# Altium schematic sheet Probe-Scope Controller v1.0.SchDoc: Probe-Scope: Controller
size Tabloid; CompanyName: Probe-Scope; Organization: Probe-Scope; Address1: Probe-Scope: Unified USB; Address2: Oscilloscope Probe; Address3: ©2019 M. Omo, J. Rowley,; Address4: K. Hall, released under the; SheetNumber: 2; PageSetup: Record=PageOptions|CenterHorizontal=True|CenterVertical=True|PrintScale=0.96|XCorrection=1.00|YCorrection=1.00|PrintKind=1|BorderSize=5000000|LeftOffset=0|BottomOffset=0|Orientation=2|PaperLength=1000|PaperWidth=1000|Scale=100|PaperSource=7|PrintQuality=-4|MediaType=1|DitherType=10|PaperKind=11x17|PrintScaleMode=1; License: CERN OHL v1.2
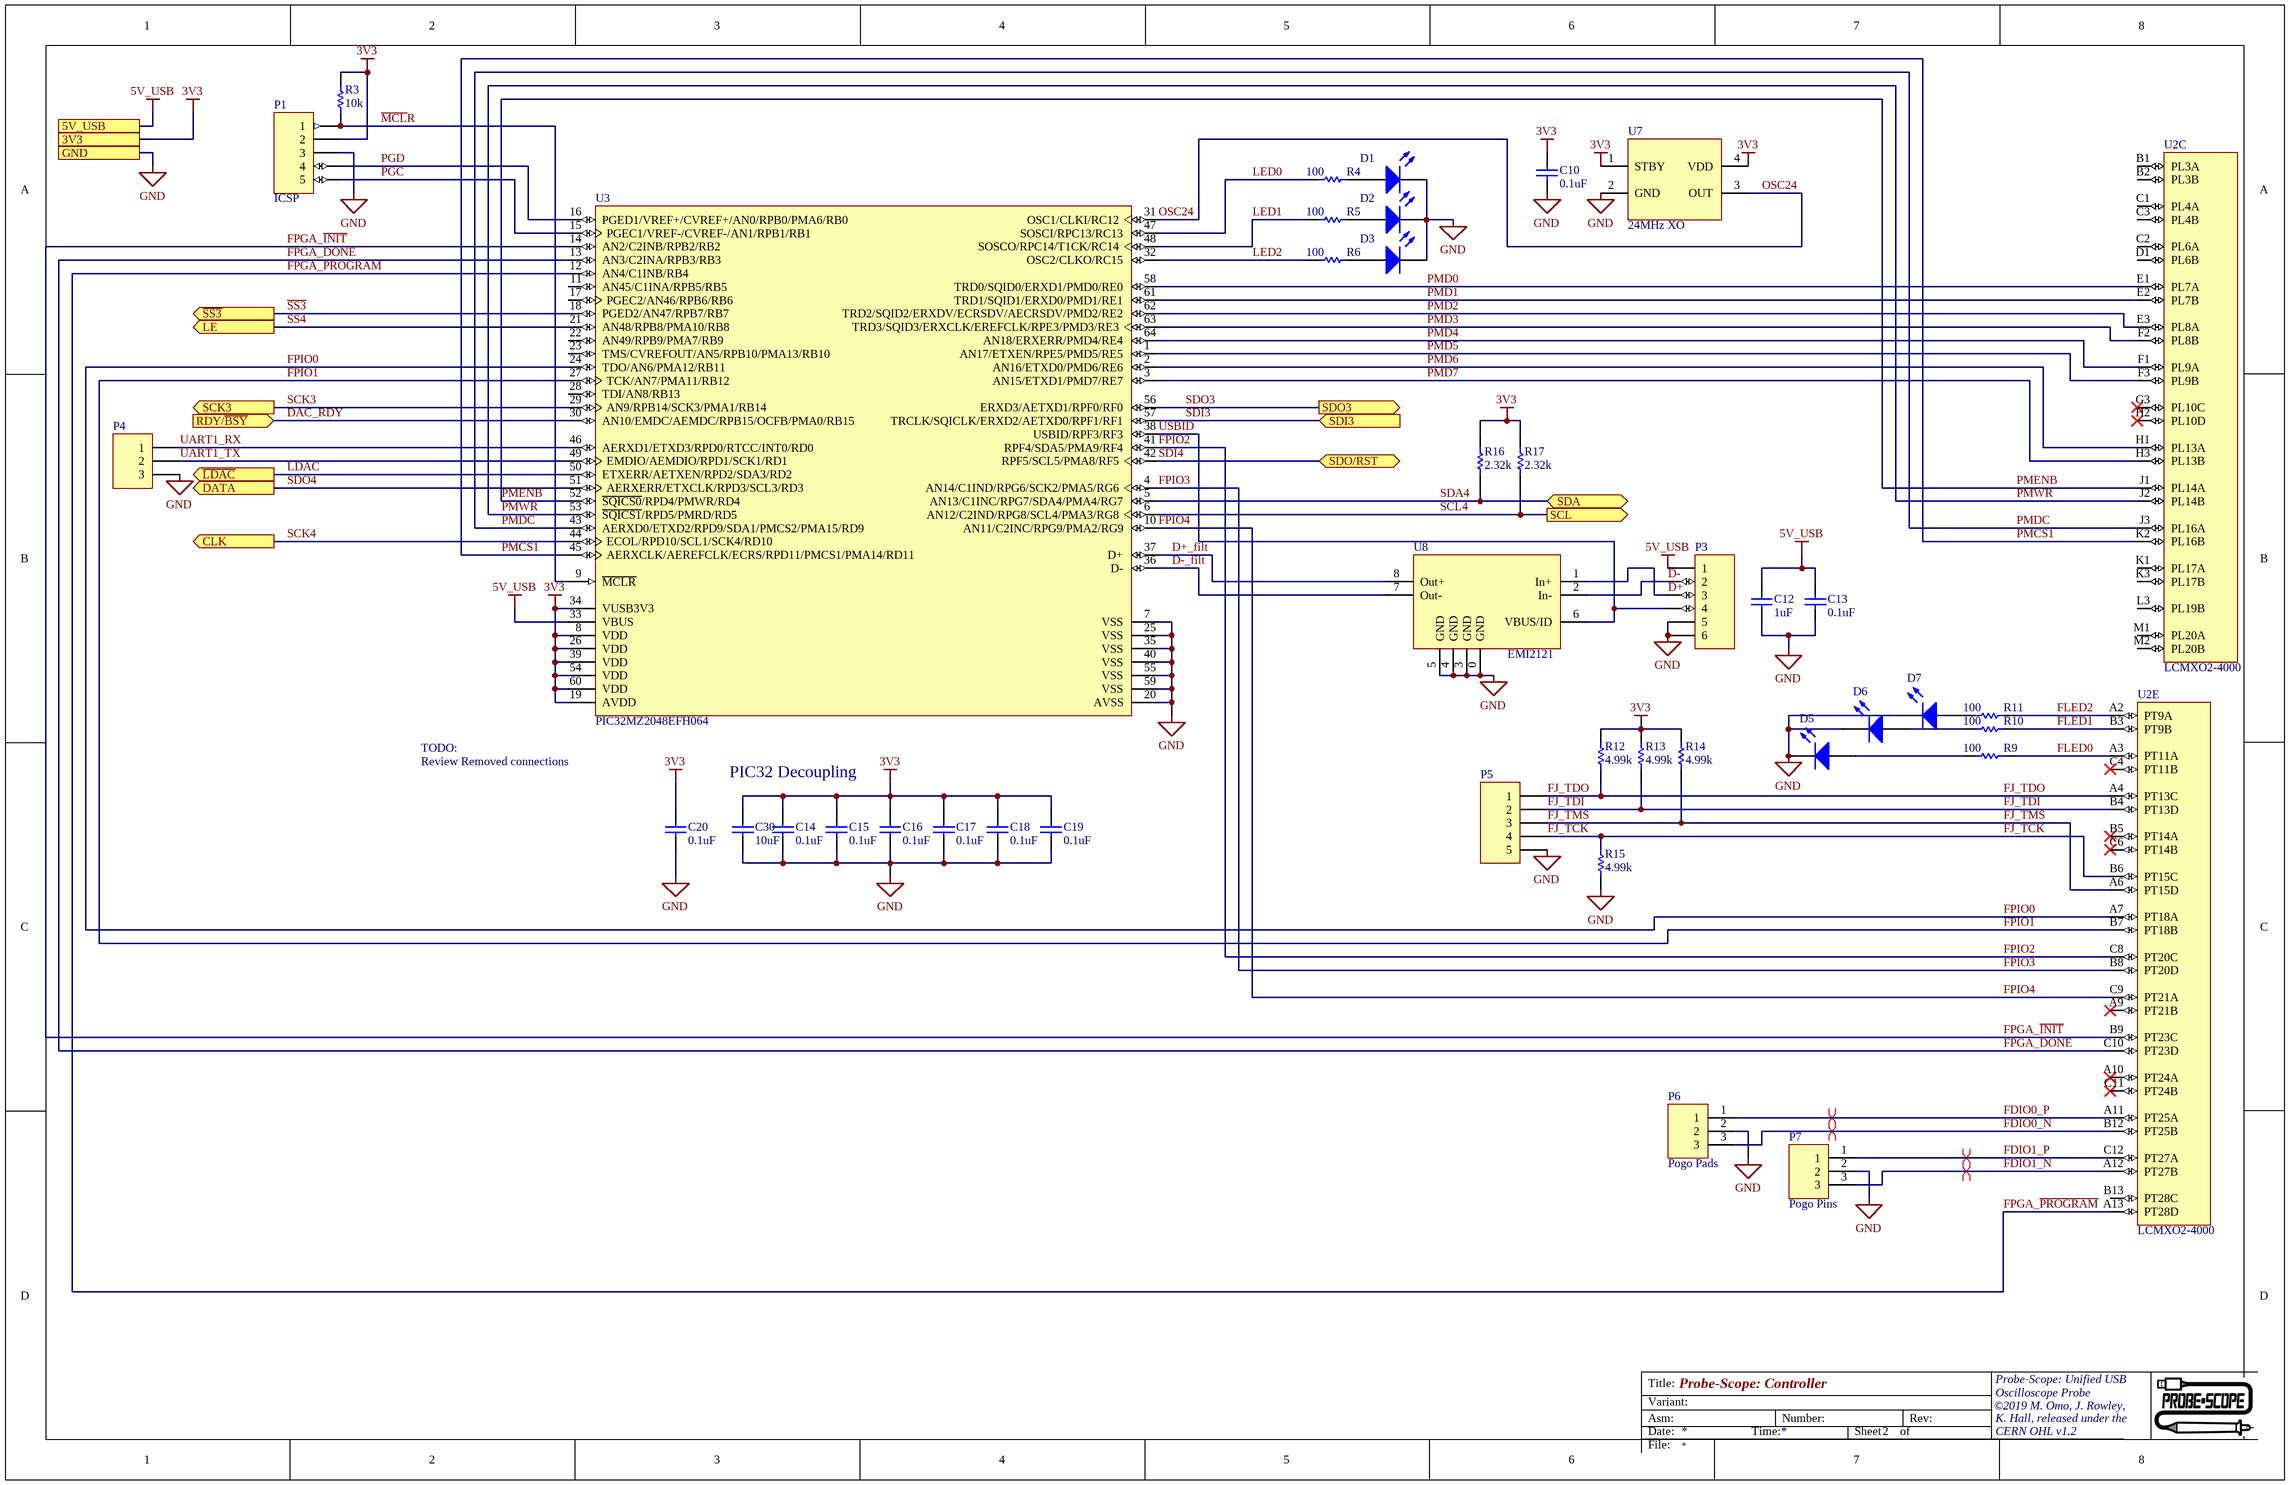
[diagram p0: Probe-Scope Controller v1.0.SchDoc]

## Parts
C10  value 0.1uF  [0402(1005)]  (hidden comment: 6.3V)
C12  value 1uF  [0402(1005)]  (hidden comment: 10V)
C13  value 0.1uF  [0402(1005)]  (hidden comment: 6.3V)
C14  value 0.1uF  [0402(1005)]  (hidden comment: 6.3V)
C15  value 0.1uF  [0402(1005)]  (hidden comment: 6.3V)
C16  value 0.1uF  [0402(1005)]  (hidden comment: 6.3V)
C17  value 0.1uF  [0402(1005)]  (hidden comment: 6.3V)
C18  value 0.1uF  [0402(1005)]  (hidden comment: 6.3V)
C19  value 0.1uF  [0402(1005)]  (hidden comment: 6.3V)
C20  value 0.1uF  [0402(1005)]  (hidden comment: 6.3V)
C30  value 10uF  [0603(1608)]  (hidden comment: 25V)
D1  Green  [0603(1608) LED]  (value not drawn)
D2  Green  [0603(1608) LED]  (value not drawn)
D3  Green  [0603(1608) LED]  (value not drawn)
D5  Green  [0603(1608) LED]  (value not drawn)
D6  Green  [0603(1608) LED]  (value not drawn)
D7  Green  [0603(1608) LED]  (value not drawn)
P1  ICSP  [MOLEX PICOBLADE 5 POS]
P3  Micro USB  [USB Micro B ZX62]  (value not drawn)
P4  PicoBlade 3  [MOLEX PICOBLADE 3 POS]  (value not drawn)
P5  PicoBlade 5  [MOLEX PICOBLADE 5 POS]  (value not drawn)
P6  Pogo Pads  [POGO_PADS_3]
P7  Pogo Pins  [POGO_PINS_3]
R3  value 10k  [0402(1005)]  (hidden comment: 0.1% 25ppm)
R4  value 100  [0402(1005)]  (hidden comment: Res1)
R5  value 100  [0402(1005)]  (hidden comment: Res1)
R6  value 100  [0402(1005)]  (hidden comment: Res1)
R9  value 100  [0402(1005)]  (hidden comment: Res1)
R10  value 100  [0402(1005)]  (hidden comment: Res1)
R11  value 100  [0402(1005)]  (hidden comment: Res1)
R12  value 4.99k  [0402(1005)]  (hidden comment: Res1)
R13  value 4.99k  [0402(1005)]  (hidden comment: Res1)
R14  value 4.99k  [0402(1005)]  (hidden comment: Res1)
R15  value 4.99k  [0402(1005)]  (hidden comment: Res1)
R16  value 2.32k  [0402(1005)]  (hidden comment: Res1)
R17  value 2.32k  [0402(1005)]  (hidden comment: Res1)
U2  LCMXO2-4000  [132_Ball_csBGA_MachXO2]  (parts C,E of 5)
U3  PIC32MZ2048EFH064  [TSQFP50P1200X1200X120-64L]
U7  24MHz XO  [DSC60xxC]
U8  EMI2121  [EMI2121]

## Ports
3V3, 5V_USB, CLK (out), DATA (out), GND, LE (out), RDY/~{BSY} (in), SCK3 (out), SCL (out), SDA (bidir), SDI3 (in), SDO3 (out), SDO/RST (bidir), ~{LDAC} (out), ~{SS3} (out)

## Nets
3V3: C10.2 C14.2 C15.2 C16.2 C17.2 C18.2 C19.2 C20.2 C30.2 P1.2 R3.2 R12.2 R13.2 R14.2 R16.2 R17.2 U3.8(VDD) U3.19(AVDD) U3.26(VDD) U3.34(VUSB3V3) U3.39(VDD) U3.54(VDD) U3.60(VDD) U7.1(STBY) U7.4(VDD) ; port 3V3
5V_USB: C12.2 C13.2 P3.1 U3.33(VBUS) ; port 5V_USB
GND: C10.1 C12.1 C13.1 C14.1 C15.1 C16.1 C17.1 C18.1 C19.1 C20.1 C30.1 D1.2(K) D2.2(K) D3.2(K) D5.2(K) D6.2(K) D7.2(K) P1.3 P3.5 P3.6 P4.3 P5.5 P6.2 P7.2 R15.1 U3.7(VSS) U3.20(AVSS) U3.25(VSS) U3.35(VSS) U3.40(VSS) U3.55(VSS) U3.59(VSS) U7.2(GND) U8.0(GND) U8.3(GND) U8.4(GND) U8.5(GND) ; port GND
~{MCL}R: P1.1 R3.1 U3.9(~{MCLR})
~{PMW}R: U2.J2(PL14B) U3.53(~{SQICS1}/RPD5/PMRD/RD5)
D+: P3.3 U8.1(In+)
D+_filt: U3.37(D+) U8.8(Out+)
D-: P3.2 U8.2(In-)
D-_filt: U3.36(D-) U8.7(Out-)
DAC_RDY: U3.30(AN10/EMDC/AEMDC/RPB15/OCFB/PMA0/RB15) ; port RDY/~{BSY}
FDIO0_N: P6.3 U2.B12(PT25B)
FDIO0_P: P6.1 U2.A11(PT25A)
FDIO1_N: P7.3 U2.A12(PT27B)
FDIO1_P: P7.1 U2.C12(PT27A)
FJ_TCK: P5.4 R15.2 U2.B6(PT15C)
FJ_TDI: P5.2 R13.1 U2.B4(PT13D)
FJ_TDO: P5.1 R12.1 U2.A4(PT13C)
FJ_TMS: P5.3 R14.1 U2.A6(PT15D)
FLED0: R9.2 U2.A3(PT11A)
FLED1: R10.2 U2.B3(PT9B)
FLED2: R11.2 U2.A2(PT9A)
FPGA_DONE: U2.C10(PT23D) U3.13(AN3/C2INA/RPB3/RB3)
FPGA_~{INIT}: U2.B9(PT23C) U3.14(AN2/C2INB/RPB2/RB2)
FPGA_~{PROGRAM}: U2.A13(PT28D) U3.12(AN4/C1INB/RB4)
FPIO0: U2.A7(PT18A) U3.24(TDO/AN6/PMA12/RB11)
FPIO1: U2.B7(PT18B) U3.27(TCK/AN7/PMA11/RB12)
FPIO2: U2.C8(PT20C) U3.41(RPF4/SDA5/PMA9/RF4)
FPIO3: U2.B8(PT20D) U3.4(AN14/C1IND/RPG6/SCK2/PMA5/RG6)
FPIO4: U2.C9(PT21A) U3.10(AN11/C2INC/RPG9/PMA2/RG9)
~{LDAC}: U3.50(ETXERR/AETXEN/RPD2/SDA3/RD2) ; port ~{LDAC}
LED0: R4.1 U3.47(SOSCI/RPC13/RC13)
LED1: R5.1 U3.48(SOSCO/RPC14/T1CK/RC14)
LED2: R6.1 U3.32(OSC2/CLKO/RC15)
OSC24: U3.31(OSC1/CLKI/RC12) U7.3(OUT)
PGC: P1.5 U3.15(PGEC1/VREF-/CVREF-/AN1/RPB1/RB1)
PGD: P1.4 U3.16(PGED1/VREF+/CVREF+/AN0/RPB0/PMA6/RB0)
PMCS1: U2.K2(PL16B) U3.45(AERXCLK/AEREFCLK/ECRS/RPD11/PMCS1/PMA14/RD11)
PMD0: U2.E1(PL7A) U3.58(TRD0/SQID0/ERXD1/PMD0/RE0)
PMD1: U2.E2(PL7B) U3.61(TRD1/SQID1/ERXD0/PMD1/RE1)
PMD2: U2.E3(PL8A) U3.62(TRD2/SQID2/ERXDV/ECRSDV/AECRSDV/PMD2/RE2)
PMD3: U2.F2(PL8B) U3.63(TRD3/SQID3/ERXCLK/EREFCLK/RPE3/PMD3/RE3)
PMD4: U2.F1(PL9A) U3.64(AN18/ERXERR/PMD4/RE4)
PMD5: U2.F3(PL9B) U3.1(AN17/ETXEN/RPE5/PMD5/RE5)
PMD6: U2.H1(PL13A) U3.2(AN16/ETXD0/PMD6/RE6)
PMD7: U2.H3(PL13B) U3.3(AN15/ETXD1/PMD7/RE7)
PMDC: U2.J3(PL16A) U3.43(AERXD0/ETXD2/RPD9/SDA1/PMCS2/PMA15/RD9)
PMENB: U2.J1(PL14A) U3.52(~{SQICS0}/RPD4/PMWR/RD4)
~{SS3}: U3.18(PGED2/AN47/RPB7/RB7) ; port ~{SS3}
~{SS4}: U3.21(AN48/RPB8/PMA10/RB8) ; port LE
SCK3: U3.29(AN9/RPB14/SCK3/PMA1/RB14) ; port SCK3
SCK4: U3.44(ECOL/RPD10/SCL1/SCK4/RD10) ; port CLK
SCL4: R17.1 U3.6(AN12/C2IND/RPG8/SCL4/PMA3/RG8) ; port SCL
SDA4: R16.1 U3.5(AN13/C1INC/RPG7/SDA4/PMA4/RG7) ; port SDA
SDI3: U3.57(TRCLK/SQICLK/ERXD2/AETXD0/RPF1/RF1) ; port SDI3
SDI4: U3.42(RPF5/SCL5/PMA8/RF5) ; port SDO/RST
SDO3: U3.56(ERXD3/AETXD1/RPF0/RF0) ; port SDO3
SDO4: U3.51(AERXERR/ETXCLK/RPD3/SCL3/RD3) ; port DATA
UART1_RX: P4.1 U3.46(AERXD1/ETXD3/RPD0/RTCC/INT0/RD0)
UART1_TX: P4.2 U3.49(EMDIO/AEMDIO/RPD1/SCK1/RD1)
USBID: P3.4 U3.38(USBID/RPF3/RF3) U8.6(VBUS/ID)
NetD1_1: D1.1(A) R4.2
NetD2_1: D2.1(A) R5.2
NetD3_1: D3.1(A) R6.2
NetD5_1: D5.1(A) R9.1
NetD6_1: D6.1(A) R10.1
NetD7_1: D7.1(A) R11.1

Not connected (* = marked no-connect by the designer): U2 A9(PT21B)* A10(PT24A)* B1(PL3A) B2(PL3B) B5(PT14A)* B13(PT28C) C1(PL4A) C2(PL6A) C3(PL4B) C4(PT11B)* C6(PT14B)* C11(PT24B)* D1(PL6B) G3(PL10C)* H2(PL10D)* K1(PL17A) K3(PL17B) L3(PL19B) M1(PL20A) M2(PL20B); U3 11(AN45/C1INA/RPB5/RB5) 17(PGEC2/AN46/RPB6/RB6) 22(AN49/RPB9/PMA7/RB9) 23(TMS/CVREFOUT/AN5/RPB10/PMA13/RB10) 28(TDI/AN8/RB13)

## Layout directives
differential pair: FDIO0_N, FDIO0_P, FDIO1_N, FDIO1_P

## Notes on the sheet
- TODO:
- Review Removed connections
- PIC32 Decoupling
- Title:
- Asm:
- Date:
- Variant:
- Time:
- Number:
- Sheet
- of
- Rev:
- File:

## Library data of the parts
C10 C13-C20 = 1875: Key: 1875; MENG_PN: ???1875; MANF: Samsung Electro-Mechanics; MANF_PN: CL05B104KQ5NNNC; VENDOR: Digikey; VENDOR_PN: 1276-1511-1-ND; P&V Description: Capacitor, Ceramic, 0.1uF, 6.3V, 10% Tol, 125C, X7R, 0402, SMD; Class: Capacitor; Type: Ceramic; Other: X7R; Tolerance: 10; Voltage: 6.3; Max Temperature: 125; Approved: False; Package: 0402; SMD: True; Date Modified: 11/6/2018 11:14:02 AM; Modified By: jrowley; Parent Key: 1875; Verified: False
C12 = 1876: Key: 1876; MENG_PN: ???1876; MANF: Murata Electronics; MANF_PN: GCM155C71A105KE38D; VENDOR: Digikey; VENDOR_PN: 490-13409-1-ND; P&V Description: Capacitor, Ceramic, 1uF, 10V, 10% Tol, 125C, X7S, 0402, SMD; Class: Capacitor; Type: Ceramic; Other: X7S; Tolerance: 10; Max Temperature: 125; Approved: False; Package: 0402; SMD: True; Date Modified: 11/6/2018 11:19:13 AM; Modified By: jrowley; Voltage: 10; Parent Key: 1876; Verified: False
C30 = 1306: Key: 1306; MENG_PN: ???1306; MANF: Samsung Electro-Mechanics; MANF_PN: CL10A106MA8NRNC; VENDOR: Digikey; VENDOR_PN: 1276-1869-1-ND; P&V Description: Capacitor, Ceramic, 10uF, 25V, 20% Tol, 85C, X5R, 0603, SMD; Class: Capacitor; Type: Ceramic; Other: X5R; Tolerance: 20; Voltage: 25; Max Temperature: 85; Approved: True; Package: 0603; SMD: True; Date Modified: 3/3/2015 11:08:29 AM; Modified By: sotterbacher; Parent Key: 1306; Verified: True
D1-D3 D5-D7 = 798: Key: 798; MENG_PN: ???798; MANF: OSRAM; MANF_PN: LG L29K-F2J1-24; VENDOR: Digikey; VENDOR_PN: 475-1193-1-ND; P&V Description: LED, 1.7V, 0.02A, Green, 570nm, diffused, 0603, SMD; Class: LED; Other: Green, 570nm, diffused; Voltage: 1.7; Current: 0.02; Approved: True; Package: 0603; SMD: True; Date Modified: 11/4/2014 3:14:11 PM; Modified By: pmarcus; Parent Key: 798; Verified: True
P1 P5 = 1316: Key: 1316; MENG_PN: ???1316; MANF: Molex; MANF_PN: 53047-0510; VENDOR: Digikey; VENDOR_PN: WM1734-ND; P&V Description: Connector, PicoBlade, 5 Positions, Male, 0.049" Spacing, 1A, 125V, Vert, Through Hole, Locking, Tin; Class: Connector; Other: Vert, Through Hole, Locking, Tin; Current: 1; Voltage: 125; Positions: 5; Spacing: 0.049; Sex: Male; Approved: True; Type: PicoBlade; SMD: False; Date Modified: 4/3/2015 6:22:35 PM; Modified By: pmarcus; Parent Key: 1316; Verified: True
P3 = 1830: Key: 1830; MENG_PN: ???1830; MANF: Amphenol FCI; MANF_PN: 10118192-0002LF; VENDOR: Digikey; VENDOR_PN: 609-5379-1-ND; P&V Description: Connector, USB, 5 Positions, Female, 0.026" Spacing, 1.8A, 100V, USB - micro B USB 2.0 Receptacle Connector 5 Position Surface Mount, Right Angle, Without Flange, SMD; Class: Connector; Other: USB - micro B USB 2.0 Receptacle Connector 5 Position Surface Mount, Right Angle, Without Flange; Positions: 5; Sex: Female; Approved: False; Current: 1.8; Voltage: 100; Spacing: 0.026; Type: USB; SMD: True; Date Modified: 8/31/2018 2:15:27 PM; Modified By: jrowley; Parent Key: 1830; Verified: False
P4 = 1286: Key: 1286; MENG_PN: ???1286; MANF: Molex; MANF_PN: 53047-0310; VENDOR: Digikey; VENDOR_PN: WM1732-ND; P&V Description: Connector, PicoBlade, 3 Positions, Male, 0.049" Spacing, 1A, 125V, Vert, Through Hole, Locking, Tin; Class: Connector; Other: Vert, Through Hole, Locking, Tin; Current: 1; Voltage: 125; Positions: 3; Spacing: 0.049; Sex: Male; Approved: True; Type: PicoBlade; SMD: False; Date Modified: 2/19/2015 4:08:35 PM; Modified By: rlaity; Parent Key: 1286; Verified: True
P6 = POGO_PADS_3
P7 = POGO_PINS_3: MANF: Prec-Dip; MANF_PN: 811-SS-003-30-002101; VENDOR: DigiKey; VENDOR_PN: 1212-1561-ND
R3 = 1806: KEY: 1806; MENG_PN: ???1806; MANF: Stackpole Electronics; MANF_PN: RMCF0402FT10K0; VENDOR: Digikey; VENDOR_PN: RMCF0402FT10K0CT-ND; P&V Description: Resistor, Thick Film, 10k Ohms, 0.0625W, 1% Tol, 100V, 0402, SMD; Class: Resistor; Tolerance: 1; Power: 0.0625; Voltage: 100; Approved: False; Type: Thick Film; Package: 0402; SMD: True; Date Modified: 8/27/2018 6:34:02 PM; Modified By: jrowley; Expr1026: 1806; Parent Key: 1806; Verified: False
R4-R6 R9-R11 = 1823: KEY: 1823; MENG_PN: ???1823; MANF: Yageo; MANF_PN: RC0402FR-07100RL; VENDOR: Digikey; VENDOR_PN: 311-100LRCT-ND; P&V Description: Resistor, Thick Film, 100 Ohms, 0.0625W, 1% Tol, 100V, 0402, SMD; Class: Resistor; Tolerance: 1; Power: 0.0625; Approved: False; Type: Thick Film; Package: 0402; SMD: True; Date Modified: 8/29/2018 2:46:23 AM; Modified By: jrowley; Voltage: 100; Expr1026: 1823; Parent Key: 1823; Verified: False
R12-R15 = 1871: Key: 1871; MENG_PN: ???1871; MANF: Yageo; MANF_PN: RC0402FR-074K99L; VENDOR: Digikey; VENDOR_PN: 311-4.99KLRCT-ND; P&V Description: Resistor, Thick Film, 4.99k Ohms, 0.063W, 1% Tol, RES SMD 4.99K OHM 1% 1/16W 0402, 0402, SMD; Class: Resistor; Other: RES SMD 4.99K OHM 1% 1/16W 0402; Tolerance: 1; Power: 0.063; Approved: False; Type: Thick Film; Package: 0402; SMD: True; Date Modified: 11/5/2018 1:44:43 PM; Modified By: khall; Expr1026: 1871; Parent Key: 1871; Verified: False
R16 R17 = 1892: Key: 1892; MANF: Stackpole Electronics; MANF_PN: RMCF0402FT2K32; VENDOR: Digikey; VENDOR_PN: RMCF0402FT2K32CT-ND; P&V Description: Resistor, Thick Film, 2.32k Ohms, 0.0625W, 1% Tol, 2.32 kOhms ±1% 0.063W, 1/16W Chip Resistor 0402 (1005 Metric) Automotive AEC-Q200 Thick Film, 0402, SMD; Class: Resistor; Other: 2.32 kOhms ±1% 0.063W, 1/16W Chip Resistor 0402 (1005 Metric) Automotive AEC-Q200 Thick Film; Tolerance: 1; Power: 0.0625; Approved: False; MENG_PN: 1892; Type: Thick Film; Package: 0402; SMD: True; Date Modified: 12/12/2018 9:31:20 AM; Modified By: khall; Expr1026: 1892; Parent Key: 1892; Verified: False
U2 = MachXO2-4000: MANF_PN: LCMXO2-4000HC-4MG132C; MANF: Lattice Semiconductor; VENDOR: DigiKey; VENDOR_PN: 220-1458-ND
U3 = PIC32MZ2048EFH064-I/PT: Microchip PIC32MZ EF Series 64-pin; VENDOR_PN: PIC32MZ2048EFH064-I/PT-ND; MANF: Microchip Technology; VENDOR: DigiKey; MANF_PN: PIC32MZ2048EFH064-I/PT
U7 = 2055: Key: 2055; MENG_PN: ???2055; MANF: Microchip; MANF_PN: DSC6011JI1A-024.0000; VENDOR: Digikey; VENDOR_PN: DSC6011JI1A-024.0000-ND; P&V Description: IC, Oscillator, 24MHz XO (Standard) CMOD Oscillator, 1.71-3.63V, Standby (Power Down), 4-SMD, SMD; Class: IC; Other: 24MHz XO (Standard) CMOD Oscillator, 1.71-3.63V, Standby (Power Down); Approved: False; Type: Oscillator; Package: 4-SMD; SMD: True; Date Modified: 6/13/2019 1:30:40 AM; Modified By: jrowley; Parent Key: 2055; Verified: False
U8 = 2056: Key: 2056; MENG_PN: ???2056; MANF: On Semiconductor; MANF_PN: EMI2121MTTAG; VENDOR: Digikey; VENDOR_PN: EMI2121MTTAGOSCT-ND; P&V Description: IC, Channel Protector, USB Common-Mode Filter and ESD Protection, WDFN-8, SMD; Class: IC; Other: USB Common-Mode Filter and ESD Protection; Approved: False; Type: Channel Protector; Package: WDFN-8; SMD: True; Date Modified: 6/13/2019 8:04:40 AM; Modified By: jrowley; Parent Key: 2056; Verified: False